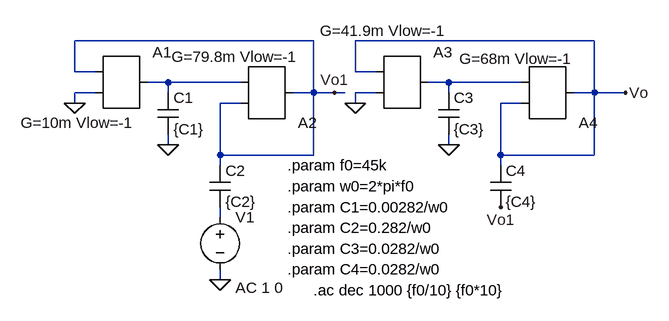
[diagram p0: schematic TP8.asc]
TP8.asc, the LTspice schematic file:
Version 4
SHEET 1 900 680
WIRE 352 64 -16 64
WIRE 784 64 416 64
WIRE -16 112 -16 64
WIRE 16 112 -16 112
WIRE 416 112 416 64
WIRE 448 112 416 112
WIRE 128 128 96 128
WIRE 240 128 128 128
WIRE 560 128 528 128
WIRE 672 128 560 128
WIRE 16 144 -16 144
WIRE 128 144 128 128
WIRE 352 144 352 64
WIRE 352 144 320 144
WIRE 384 144 352 144
WIRE 400 144 384 144
WIRE 448 144 416 144
WIRE 560 144 560 128
WIRE 784 144 784 64
WIRE 784 144 752 144
WIRE 832 144 784 144
WIRE -16 160 -16 144
WIRE 240 160 208 160
WIRE 416 160 416 144
WIRE 672 160 640 160
WIRE 128 224 128 208
WIRE 560 224 560 208
WIRE 208 240 208 160
WIRE 352 240 352 144
WIRE 352 240 208 240
WIRE 640 240 640 160
WIRE 784 240 784 144
WIRE 784 240 640 240
WIRE 208 256 208 240
WIRE 640 256 640 240
WIRE 208 336 208 320
WIRE 208 432 208 416
FLAG 128 224 0
FLAG -16 160 0
FLAG 560 224 0
FLAG 416 160 0
FLAG 208 432 0
FLAG 384 144 Vo1
FLAG 640 320 Vo1
FLAG 832 144 Vo
SYMBOL SpecialFunctions\\ota 48 64 R0
WINDOW 3 -147 126 Left 2
SYMATTR InstName A1
SYMATTR Value G=10m Vlow=-1
SYMBOL SpecialFunctions\\ota 272 208 M180
WINDOW 3 -139 119 Left 2
SYMATTR InstName A2
SYMATTR Value G=79.8m Vlow=-1
SYMBOL cap 112 144 R0
SYMATTR InstName C1
SYMATTR Value {C1}
SYMBOL cap 192 256 R0
SYMATTR InstName C2
SYMATTR Value {C2}
SYMBOL SpecialFunctions\\ota 480 64 R0
WINDOW 3 -118 -15 Left 2
SYMATTR InstName A3
SYMATTR Value G=41.9m Vlow=-1
SYMBOL SpecialFunctions\\ota 704 208 M180
WINDOW 3 -128 116 Left 2
SYMATTR InstName A4
SYMATTR Value G=68m Vlow=-1
SYMBOL cap 544 144 R0
SYMATTR InstName C3
SYMATTR Value {C3}
SYMBOL cap 624 256 R0
SYMATTR InstName C4
SYMATTR Value {C4}
SYMBOL voltage 208 320 R0
WINDOW 123 24 124 Left 2
WINDOW 39 0 0 Left 0
SYMATTR InstName V1
SYMATTR Value ""
SYMATTR Value2 AC 1 0
TEXT 352 448 Left 2 !.ac dec 1000 {f0/10} {f0*10}
TEXT 312 320 Left 2 !.param C1=0.00282/w0
TEXT 312 352 Left 2 !.param C2=0.282/w0
TEXT 312 384 Left 2 !.param C3=0.0282/w0
TEXT 312 416 Left 2 !.param C4=0.0282/w0
TEXT 312 288 Left 2 !.param w0=2*pi*f0
TEXT 312 256 Left 2 !.param f0=45k

The netlist it stands for:
* TP8.asc
A1 Vo1 0 0 0 0 0 N001 0 OTA G=10m Vlow=-1
A2 Vo1 N001 0 0 0 0 Vo1 0 OTA G=79.8m Vlow=-1
C1 N001 0 {C1}
C2 Vo1 N003 {C2}
A3 Vo 0 0 0 0 0 N002 0 OTA G=41.9m Vlow=-1
A4 Vo N002 0 0 0 0 Vo 0 OTA G=68m Vlow=-1
C3 N002 0 {C3}
C4 Vo Vo1 {C4}
V1 N003 0 AC 1 0
.ac dec 1000 {f0/10} {f0*10}
.param C1=0.00282/w0
.param C2=0.282/w0
.param C3=0.0282/w0
.param C4=0.0282/w0
.param w0=2*pi*f0
.param f0=45k
.backanno
.end